# Altium schematic sheet Config_Interfaces.SchDoc: CONFIG. INTERFACES
size A4; DocumentNumber: 3; SheetNumber: 3; SheetTotal: 18
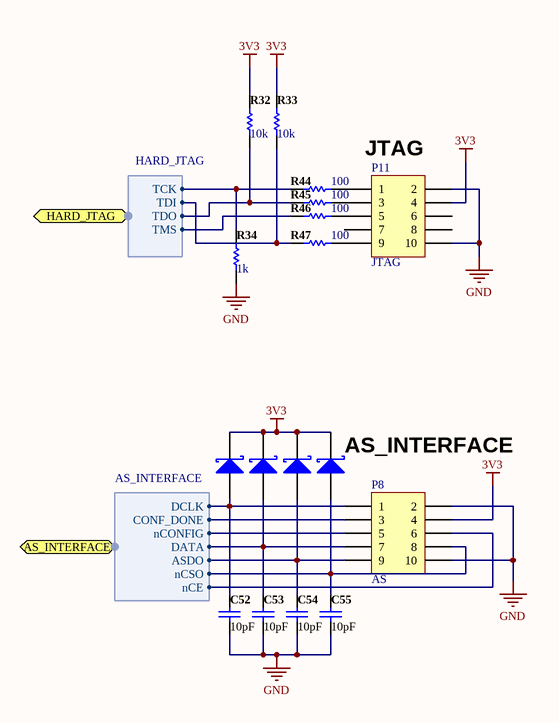
[diagram p0: Config_Interfaces.SchDoc]

## Parts
C52  10pF  [0805C-GENERIC]
C53  10pF  [0805C-GENERIC]
C54  10pF  [0805C-GENERIC]
C55  10pF  [0805C-GENERIC]
D10  D Schottky  [LED-0805-K]  (value not drawn)
D11  D Schottky  [LED-0805-K]  (value not drawn)
D12  D Schottky  [LED-0805-K]  (value not drawn)
D13  D Schottky  [LED-0805-K]  (value not drawn)
P8  Header 5X2  [10P_PCB_HEADER_BRD_MNT]  (value not drawn)
P11  Header 5X2  [10P_PCB_HEADER_BRD_MNT]  (value not drawn)
R32  10k  [0805R-10K]
R33  10k  [0805R-10K]
R34  1k  [0805R-1K]
R44  100  [0805R-100]
R45  100  [0805R-100]
R46  100  [0805R-100]
R47  100  [0805R-100]

## Ports
AS_INTERFACE (harness AS_INTERFACE), HARD_JTAG (harness HARD_JTAG)

## Harnesses
HARD_JTAG: TCK, TDI, TDO, TMS
AS_INTERFACE: DCLK, CONF_DONE, nCONFIG, ASDO, nCE, nCSO, DATA

## Nets
3V3: D10.K D11.K D12.K D13.K P8.4 P11.4 R32.1 R33.1
GND: C52.2 C53.2 C54.2 C55.2 P8.2 P8.10 P11.2 P11.10 R34.2
NetC52_1: C52.1 D10.A P8.1 ; port AS_INTERFACE.DCLK
NetC53_1: C53.1 D11.A P8.7 ; port AS_INTERFACE.DATA
NetC54_1: C54.1 D12.A P8.9 ; port AS_INTERFACE.ASDO
NetC55_1: C55.1 D13.A P8.8 ; port AS_INTERFACE.nCSO
NetP8_3: P8.3 ; port AS_INTERFACE.CONF_DONE
NetP8_5: P8.5 ; port AS_INTERFACE.nCONFIG
NetP8_6: P8.6 ; port AS_INTERFACE.nCE
NetP11_1: P11.1 R44.2
NetP11_3: P11.3 R45.2
NetP11_5: P11.5 R46.2
NetP11_9: P11.9 R47.2
NetR32_2: R32.2 R45.1 ; port HARD_JTAG.TDO
NetR33_2: R33.2 R47.1 ; port HARD_JTAG.TDI
NetR34_1: R34.1 R44.1 ; port HARD_JTAG.TCK
NetR46_1: R46.1 ; port HARD_JTAG.TMS

Not connected (* = marked no-connect by the designer): P11 6 7 8

## Notes on the sheet
- JTAG
- (near P11) JTAG
- (near D13) AS_INTERFACE
- (near P8) AS
- Title
- Size:
- Date:
- A4
- Number:
- Time:
- Revision:
- Sheet
- of
- File:

## Library data of the parts
C52-C55 = D-101-0027: Capacitor, Ceramic, 10% 10V 0805 X7R; Polarity: Non-Polarized; Capacitance: 10pF; Dielectric: X7R; Mounting Technology: Surface Mount; Rated Voltage: 10 V; Status: Production; Technology: Ceramic; Tolerance: 10 %; Category: Capacitor
D10-D13 = D Schottky: Schottky Diode - SD0805S020S1R0; Published: 8-Jun-2000; LatestRevisionDate: 17-Jul-2002; LatestRevisionNote: Re-released for DXP Platform.; PackageReference: SMB; Publisher: Altium Limited; PackageDescription: 0805; Code_JEDEC: 0805
P8 P11 = Header 5X2: Header, 5-Pin, Dual row; LatestRevisionDate: 17-Jul-2002; LatestRevisionNote: Re-released for DXP Platform.; Publisher: Altium Limited
R32-R34 R44-R47 = D-100-0116: Tolerance: 1 %; Mounting Technology: Surface Mount; Status: Production; Category: Resistor
  R32 R33: Value: 10k
  R34: Value: 1k
  R44-R47: Value: 100